# EAGLE schematic AutoPad-R3-RevA (EAGLE 9.5.2), part 2 of 3
## Sheet 6 of 12
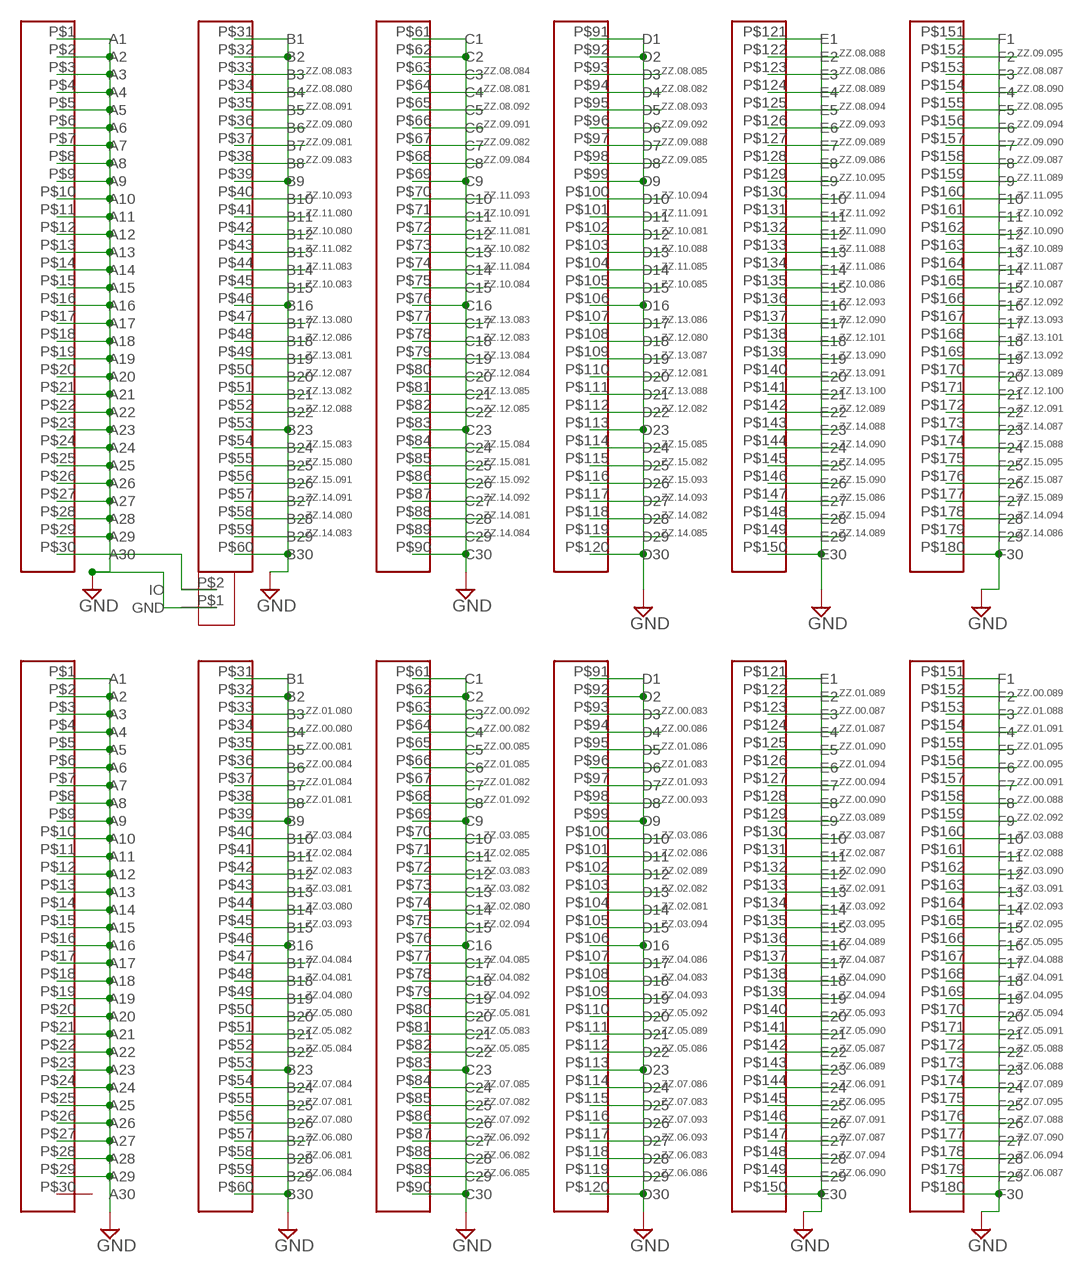
[diagram p5: schematic, sheet 6]

### Parts
U$11  SEAM-30-02.0-L-06-1-A-K-TR  [SEAM-30-02.0-L-06-1-A-K-TR]
U$12  SEAM-30-02.0-L-06-1-A-K-TR  [SEAM-30-02.0-L-06-1-A-K-TR]
U$30  DS2431  [SD2431]

### Nets
GND: U$11.P$1(A1) U$11.P$2(A2) U$11.P$3(A3) U$11.P$4(A4) U$11.P$5(A5) U$11.P$6(A6) U$11.P$7(A7) U$11.P$8(A8) U$11.P$9(A9) U$11.P$10(A10) U$11.P$11(A11) U$11.P$12(A12) U$11.P$13(A13) U$11.P$14(A14) U$11.P$15(A15) U$11.P$16(A16) U$11.P$17(A17) U$11.P$18(A18) U$11.P$19(A19) U$11.P$20(A20) U$11.P$21(A21) U$11.P$22(A22) U$11.P$23(A23) U$11.P$24(A24) U$11.P$25(A25) U$11.P$26(A26) U$11.P$27(A27) U$11.P$28(A28) U$11.P$29(A29) U$11.P$31(B1) U$11.P$32(B2) U$11.P$39(B9) U$11.P$46(B16) U$11.P$53(B23) U$11.P$60(B30) U$11.P$61(C1) U$11.P$62(C2) U$11.P$69(C9) U$11.P$76(C16) U$11.P$83(C23) U$11.P$90(C30) U$11.P$91(D1) U$11.P$92(D2) U$11.P$99(D9) U$11.P$106(D16) U$11.P$113(D23) U$11.P$120(D30) U$11.P$121(E1) U$11.P$150(E30) U$11.P$151(F1) U$11.P$180(F30) U$12.P$1(A1) U$12.P$2(A2) U$12.P$3(A3) U$12.P$4(A4) U$12.P$5(A5) U$12.P$6(A6) U$12.P$7(A7) U$12.P$8(A8) U$12.P$9(A9) U$12.P$10(A10) U$12.P$11(A11) U$12.P$12(A12) U$12.P$13(A13) U$12.P$14(A14) U$12.P$15(A15) U$12.P$16(A16) U$12.P$17(A17) U$12.P$18(A18) U$12.P$19(A19) U$12.P$20(A20) U$12.P$21(A21) U$12.P$22(A22) U$12.P$23(A23) U$12.P$24(A24) U$12.P$25(A25) U$12.P$26(A26) U$12.P$27(A27) U$12.P$28(A28) U$12.P$29(A29) U$12.P$31(B1) U$12.P$32(B2) U$12.P$39(B9) U$12.P$46(B16) U$12.P$53(B23) U$12.P$60(B30) U$12.P$61(C1) U$12.P$62(C2) U$12.P$69(C9) U$12.P$76(C16) U$12.P$83(C23) U$12.P$90(C30) U$12.P$91(D1) U$12.P$92(D2) U$12.P$99(D9) U$12.P$106(D16) U$12.P$113(D23) U$12.P$120(D30) U$12.P$121(E1) U$12.P$150(E30) U$12.P$151(F1) U$12.P$180(F30) U$30.P$1(GND) ; also sheet 1,2,3,4,5,7,8,9,10,11,12
N$6: U$11.P$30(A30) U$30.P$2(IO)
ZZ.00.080: U$12.P$34(B4)
ZZ.00.081: U$12.P$35(B5)
ZZ.00.082: U$12.P$64(C4)
ZZ.00.083: U$12.P$93(D3)
ZZ.00.084: U$12.P$36(B6)
ZZ.00.085: U$12.P$65(C5)
ZZ.00.086: U$12.P$94(D4)
ZZ.00.087: U$12.P$123(E3)
ZZ.00.088: U$12.P$158(F8)
ZZ.00.089: U$12.P$152(F2)
ZZ.00.090: U$12.P$128(E8)
ZZ.00.091: U$12.P$157(F7)
ZZ.00.092: U$12.P$63(C3)
ZZ.00.093: U$12.P$98(D8)
ZZ.00.094: U$12.P$127(E7)
ZZ.00.095: U$12.P$156(F6)
ZZ.01.080: U$12.P$33(B3)
ZZ.01.081: U$12.P$38(B8)
ZZ.01.082: U$12.P$67(C7)
ZZ.01.083: U$12.P$96(D6)
ZZ.01.084: U$12.P$37(B7)
ZZ.01.085: U$12.P$66(C6)
ZZ.01.086: U$12.P$95(D5)
ZZ.01.087: U$12.P$124(E4)
ZZ.01.088: U$12.P$153(F3)
ZZ.01.089: U$12.P$122(E2)
ZZ.01.090: U$12.P$125(E5)
ZZ.01.091: U$12.P$154(F4)
ZZ.01.092: U$12.P$68(C8)
ZZ.01.093: U$12.P$97(D7)
ZZ.01.094: U$12.P$126(E6)
ZZ.01.095: U$12.P$155(F5)
ZZ.02.080: U$12.P$74(C14)
ZZ.02.081: U$12.P$104(D14)
ZZ.02.082: U$12.P$103(D13)
ZZ.02.083: U$12.P$42(B12)
ZZ.02.084: U$12.P$41(B11)
ZZ.02.085: U$12.P$71(C11)
ZZ.02.086: U$12.P$101(D11)
ZZ.02.087: U$12.P$131(E11)
ZZ.02.088: U$12.P$161(F11)
ZZ.02.089: U$12.P$102(D12)
ZZ.02.090: U$12.P$132(E12)
ZZ.02.091: U$12.P$133(E13)
ZZ.02.092: U$12.P$159(F9)
ZZ.02.093: U$12.P$164(F14)
ZZ.02.094: U$12.P$75(C15)
ZZ.02.095: U$12.P$165(F15)
ZZ.03.080: U$12.P$44(B14)
ZZ.03.081: U$12.P$43(B13)
ZZ.03.082: U$12.P$73(C13)
ZZ.03.083: U$12.P$72(C12)
ZZ.03.084: U$12.P$40(B10)
ZZ.03.085: U$12.P$70(C10)
ZZ.03.086: U$12.P$100(D10)
ZZ.03.087: U$12.P$130(E10)
ZZ.03.088: U$12.P$160(F10)
ZZ.03.089: U$12.P$129(E9)
ZZ.03.090: U$12.P$162(F12)
ZZ.03.091: U$12.P$163(F13)
ZZ.03.092: U$12.P$134(E14)
ZZ.03.093: U$12.P$45(B15)
ZZ.03.094: U$12.P$105(D15)
ZZ.03.095: U$12.P$135(E15)
ZZ.04.080: U$12.P$49(B19)
ZZ.04.081: U$12.P$48(B18)
ZZ.04.082: U$12.P$78(C18)
ZZ.04.083: U$12.P$108(D18)
ZZ.04.084: U$12.P$47(B17)
ZZ.04.085: U$12.P$77(C17)
ZZ.04.086: U$12.P$107(D17)
ZZ.04.087: U$12.P$137(E17)
ZZ.04.088: U$12.P$167(F17)
ZZ.04.089: U$12.P$136(E16)
ZZ.04.090: U$12.P$138(E18)
ZZ.04.091: U$12.P$168(F18)
ZZ.04.092: U$12.P$79(C19)
ZZ.04.093: U$12.P$109(D19)
ZZ.04.094: U$12.P$139(E19)
ZZ.04.095: U$12.P$169(F19)
ZZ.05.080: U$12.P$50(B20)
ZZ.05.081: U$12.P$80(C20)
ZZ.05.082: U$12.P$51(B21)
ZZ.05.083: U$12.P$81(C21)
ZZ.05.084: U$12.P$52(B22)
ZZ.05.085: U$12.P$82(C22)
ZZ.05.086: U$12.P$112(D22)
ZZ.05.087: U$12.P$142(E22)
ZZ.05.088: U$12.P$172(F22)
ZZ.05.089: U$12.P$111(D21)
ZZ.05.090: U$12.P$141(E21)
ZZ.05.091: U$12.P$171(F21)
ZZ.05.092: U$12.P$110(D20)
ZZ.05.093: U$12.P$140(E20)
ZZ.05.094: U$12.P$170(F20)
ZZ.05.095: U$12.P$166(F16)
ZZ.06.080: U$12.P$57(B27)
ZZ.06.081: U$12.P$58(B28)
ZZ.06.082: U$12.P$88(C28)
ZZ.06.083: U$12.P$118(D28)
ZZ.06.084: U$12.P$59(B29)
ZZ.06.085: U$12.P$89(C29)
ZZ.06.086: U$12.P$119(D29)
ZZ.06.087: U$12.P$179(F29)
ZZ.06.088: U$12.P$173(F23)
ZZ.06.089: U$12.P$143(E23)
ZZ.06.090: U$12.P$149(E29)
ZZ.06.091: U$12.P$144(E24)
ZZ.06.092: U$12.P$87(C27)
ZZ.06.093: U$12.P$117(D27)
ZZ.06.094: U$12.P$178(F28)
ZZ.06.095: U$12.P$145(E25)
ZZ.07.080: U$12.P$56(B26)
ZZ.07.081: U$12.P$55(B25)
ZZ.07.082: U$12.P$85(C25)
ZZ.07.083: U$12.P$115(D25)
ZZ.07.084: U$12.P$54(B24)
ZZ.07.085: U$12.P$84(C24)
ZZ.07.086: U$12.P$114(D24)
ZZ.07.087: U$12.P$147(E27)
ZZ.07.088: U$12.P$176(F26)
ZZ.07.089: U$12.P$174(F24)
ZZ.07.090: U$12.P$177(F27)
ZZ.07.091: U$12.P$146(E26)
ZZ.07.092: U$12.P$86(C26)
ZZ.07.093: U$12.P$116(D26)
ZZ.07.094: U$12.P$148(E28)
ZZ.07.095: U$12.P$175(F25)
ZZ.08.080: U$11.P$34(B4)
ZZ.08.081: U$11.P$64(C4)
ZZ.08.082: U$11.P$94(D4)
ZZ.08.083: U$11.P$33(B3)
ZZ.08.084: U$11.P$63(C3)
ZZ.08.085: U$11.P$93(D3)
ZZ.08.086: U$11.P$123(E3)
ZZ.08.087: U$11.P$153(F3)
ZZ.08.088: U$11.P$122(E2)
ZZ.08.089: U$11.P$124(E4)
ZZ.08.090: U$11.P$154(F4)
ZZ.08.091: U$11.P$35(B5)
ZZ.08.092: U$11.P$65(C5)
ZZ.08.093: U$11.P$95(D5)
ZZ.08.094: U$11.P$125(E5)
ZZ.08.095: U$11.P$155(F5)
ZZ.09.080: U$11.P$36(B6)
ZZ.09.081: U$11.P$37(B7)
ZZ.09.082: U$11.P$67(C7)
ZZ.09.083: U$11.P$38(B8)
ZZ.09.084: U$11.P$68(C8)
ZZ.09.085: U$11.P$98(D8)
ZZ.09.086: U$11.P$128(E8)
ZZ.09.087: U$11.P$158(F8)
ZZ.09.088: U$11.P$97(D7)
ZZ.09.089: U$11.P$127(E7)
ZZ.09.090: U$11.P$157(F7)
ZZ.09.091: U$11.P$66(C6)
ZZ.09.092: U$11.P$96(D6)
ZZ.09.093: U$11.P$126(E6)
ZZ.09.094: U$11.P$156(F6)
ZZ.09.095: U$11.P$152(F2)
ZZ.10.080: U$11.P$42(B12)
ZZ.10.081: U$11.P$102(D12)
ZZ.10.082: U$11.P$73(C13)
ZZ.10.083: U$11.P$45(B15)
ZZ.10.084: U$11.P$75(C15)
ZZ.10.085: U$11.P$105(D15)
ZZ.10.086: U$11.P$135(E15)
ZZ.10.087: U$11.P$165(F15)
ZZ.10.088: U$11.P$103(D13)
ZZ.10.089: U$11.P$163(F13)
ZZ.10.090: U$11.P$162(F12)
ZZ.10.091: U$11.P$71(C11)
ZZ.10.092: U$11.P$161(F11)
ZZ.10.093: U$11.P$40(B10)
ZZ.10.094: U$11.P$100(D10)
ZZ.10.095: U$11.P$129(E9)
ZZ.11.080: U$11.P$41(B11)
ZZ.11.081: U$11.P$72(C12)
ZZ.11.082: U$11.P$43(B13)
ZZ.11.083: U$11.P$44(B14)
ZZ.11.084: U$11.P$74(C14)
ZZ.11.085: U$11.P$104(D14)
ZZ.11.086: U$11.P$134(E14)
ZZ.11.087: U$11.P$164(F14)
ZZ.11.088: U$11.P$133(E13)
ZZ.11.089: U$11.P$159(F9)
ZZ.11.090: U$11.P$132(E12)
ZZ.11.091: U$11.P$101(D11)
ZZ.11.092: U$11.P$131(E11)
ZZ.11.093: U$11.P$70(C10)
ZZ.11.094: U$11.P$130(E10)
ZZ.11.095: U$11.P$160(F10)
ZZ.12.080: U$11.P$108(D18)
ZZ.12.081: U$11.P$110(D20)
ZZ.12.082: U$11.P$112(D22)
ZZ.12.083: U$11.P$78(C18)
ZZ.12.084: U$11.P$80(C20)
ZZ.12.085: U$11.P$82(C22)
ZZ.12.086: U$11.P$48(B18)
ZZ.12.087: U$11.P$50(B20)
ZZ.12.088: U$11.P$52(B22)
ZZ.12.089: U$11.P$142(E22)
ZZ.12.090: U$11.P$137(E17)
ZZ.12.091: U$11.P$172(F22)
ZZ.12.092: U$11.P$166(F16)
ZZ.12.093: U$11.P$136(E16)
ZZ.12.100: U$11.P$171(F21)
ZZ.12.101: U$11.P$138(E18)
ZZ.13.080: U$11.P$47(B17)
ZZ.13.081: U$11.P$49(B19)
ZZ.13.082: U$11.P$51(B21)
ZZ.13.083: U$11.P$77(C17)
ZZ.13.084: U$11.P$79(C19)
ZZ.13.085: U$11.P$81(C21)
ZZ.13.086: U$11.P$107(D17)
ZZ.13.087: U$11.P$109(D19)
ZZ.13.088: U$11.P$111(D21)
ZZ.13.089: U$11.P$170(F20)
ZZ.13.090: U$11.P$139(E19)
ZZ.13.091: U$11.P$140(E20)
ZZ.13.092: U$11.P$169(F19)
ZZ.13.093: U$11.P$167(F17)
ZZ.13.100: U$11.P$141(E21)
ZZ.13.101: U$11.P$168(F18)
ZZ.14.080: U$11.P$58(B28)
ZZ.14.081: U$11.P$88(C28)
ZZ.14.082: U$11.P$118(D28)
ZZ.14.083: U$11.P$59(B29)
ZZ.14.084: U$11.P$89(C29)
ZZ.14.085: U$11.P$119(D29)
ZZ.14.086: U$11.P$179(F29)
ZZ.14.087: U$11.P$173(F23)
ZZ.14.088: U$11.P$143(E23)
ZZ.14.089: U$11.P$149(E29)
ZZ.14.090: U$11.P$144(E24)
ZZ.14.091: U$11.P$57(B27)
ZZ.14.092: U$11.P$87(C27)
ZZ.14.093: U$11.P$117(D27)
ZZ.14.094: U$11.P$178(F28)
ZZ.14.095: U$11.P$145(E25)
ZZ.15.080: U$11.P$55(B25)
ZZ.15.081: U$11.P$85(C25)
ZZ.15.082: U$11.P$115(D25)
ZZ.15.083: U$11.P$54(B24)
ZZ.15.084: U$11.P$84(C24)
ZZ.15.085: U$11.P$114(D24)
ZZ.15.086: U$11.P$147(E27)
ZZ.15.087: U$11.P$176(F26)
ZZ.15.088: U$11.P$174(F24)
ZZ.15.089: U$11.P$177(F27)
ZZ.15.090: U$11.P$146(E26)
ZZ.15.091: U$11.P$56(B26)
ZZ.15.092: U$11.P$86(C26)
ZZ.15.093: U$11.P$116(D26)
ZZ.15.094: U$11.P$148(E28)
ZZ.15.095: U$11.P$175(F25)
Unconnected: U$12.P$30(A30)

## Sheet 7 of 12
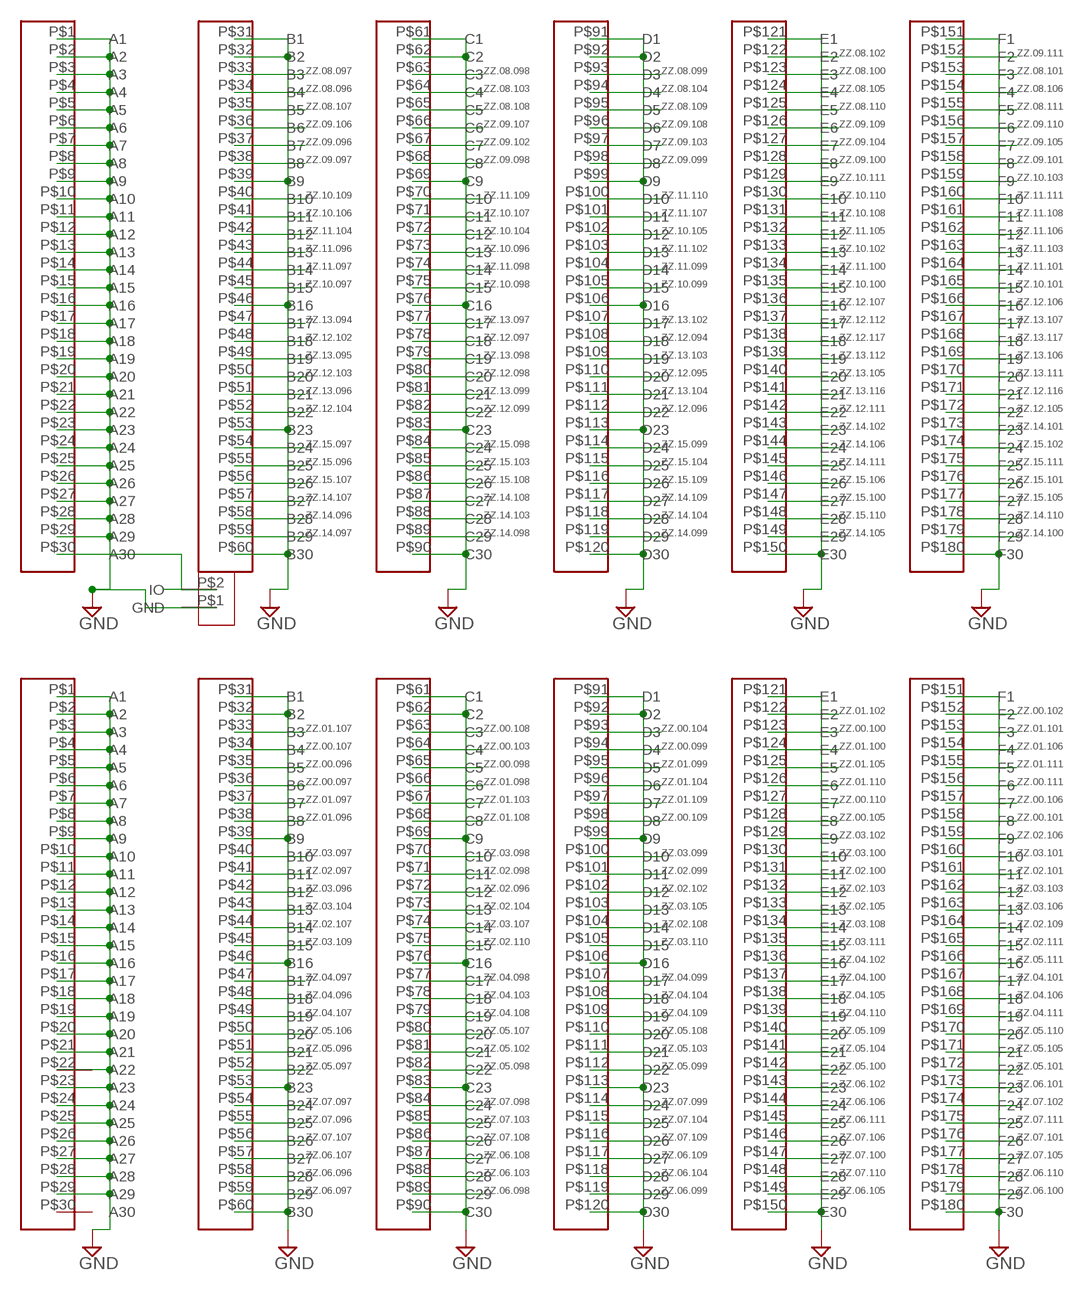
[diagram p6: schematic, sheet 7]

### Parts
U$13  SEAM-30-02.0-L-06-1-A-K-TR  [SEAM-30-02.0-L-06-1-A-K-TR]
U$14  SEAM-30-02.0-L-06-1-A-K-TR  [SEAM-30-02.0-L-06-1-A-K-TR]
U$31  DS2431  [SD2431]

### Nets
GND: U$13.P$1(A1) U$13.P$2(A2) U$13.P$3(A3) U$13.P$4(A4) U$13.P$5(A5) U$13.P$6(A6) U$13.P$7(A7) U$13.P$8(A8) U$13.P$9(A9) U$13.P$10(A10) U$13.P$11(A11) U$13.P$12(A12) U$13.P$13(A13) U$13.P$14(A14) U$13.P$15(A15) U$13.P$16(A16) U$13.P$17(A17) U$13.P$18(A18) U$13.P$19(A19) U$13.P$20(A20) U$13.P$21(A21) U$13.P$22(A22) U$13.P$23(A23) U$13.P$24(A24) U$13.P$25(A25) U$13.P$26(A26) U$13.P$27(A27) U$13.P$28(A28) U$13.P$29(A29) U$13.P$31(B1) U$13.P$32(B2) U$13.P$39(B9) U$13.P$46(B16) U$13.P$53(B23) U$13.P$60(B30) U$13.P$61(C1) U$13.P$62(C2) U$13.P$69(C9) U$13.P$76(C16) U$13.P$83(C23) U$13.P$90(C30) U$13.P$91(D1) U$13.P$92(D2) U$13.P$99(D9) U$13.P$106(D16) U$13.P$113(D23) U$13.P$120(D30) U$13.P$121(E1) U$13.P$150(E30) U$13.P$151(F1) U$13.P$180(F30) U$14.P$1(A1) U$14.P$2(A2) U$14.P$3(A3) U$14.P$4(A4) U$14.P$5(A5) U$14.P$6(A6) U$14.P$7(A7) U$14.P$8(A8) U$14.P$9(A9) U$14.P$10(A10) U$14.P$11(A11) U$14.P$12(A12) U$14.P$13(A13) U$14.P$14(A14) U$14.P$15(A15) U$14.P$16(A16) U$14.P$17(A17) U$14.P$18(A18) U$14.P$19(A19) U$14.P$20(A20) U$14.P$21(A21) U$14.P$22(A22) U$14.P$23(A23) U$14.P$24(A24) U$14.P$25(A25) U$14.P$26(A26) U$14.P$27(A27) U$14.P$28(A28) U$14.P$29(A29) U$14.P$31(B1) U$14.P$32(B2) U$14.P$39(B9) U$14.P$46(B16) U$14.P$53(B23) U$14.P$60(B30) U$14.P$61(C1) U$14.P$62(C2) U$14.P$69(C9) U$14.P$76(C16) U$14.P$83(C23) U$14.P$90(C30) U$14.P$91(D1) U$14.P$92(D2) U$14.P$99(D9) U$14.P$106(D16) U$14.P$113(D23) U$14.P$120(D30) U$14.P$121(E1) U$14.P$150(E30) U$14.P$151(F1) U$14.P$180(F30) U$31.P$1(GND) ; also sheet 1,2,3,4,5,6,8,9,10,11,12
N$7: U$13.P$30(A30) U$31.P$2(IO)
ZZ.00.096: U$14.P$35(B5)
ZZ.00.097: U$14.P$36(B6)
ZZ.00.098: U$14.P$65(C5)
ZZ.00.099: U$14.P$94(D4)
ZZ.00.100: U$14.P$123(E3)
ZZ.00.101: U$14.P$158(F8)
ZZ.00.102: U$14.P$152(F2)
ZZ.00.103: U$14.P$64(C4)
ZZ.00.104: U$14.P$93(D3)
ZZ.00.105: U$14.P$128(E8)
ZZ.00.106: U$14.P$157(F7)
ZZ.00.107: U$14.P$34(B4)
ZZ.00.108: U$14.P$63(C3)
ZZ.00.109: U$14.P$98(D8)
ZZ.00.110: U$14.P$127(E7)
ZZ.00.111: U$14.P$156(F6)
ZZ.01.096: U$14.P$38(B8)
ZZ.01.097: U$14.P$37(B7)
ZZ.01.098: U$14.P$66(C6)
ZZ.01.099: U$14.P$95(D5)
ZZ.01.100: U$14.P$124(E4)
ZZ.01.101: U$14.P$153(F3)
ZZ.01.102: U$14.P$122(E2)
ZZ.01.103: U$14.P$67(C7)
ZZ.01.104: U$14.P$96(D6)
ZZ.01.105: U$14.P$125(E5)
ZZ.01.106: U$14.P$154(F4)
ZZ.01.107: U$14.P$33(B3)
ZZ.01.108: U$14.P$68(C8)
ZZ.01.109: U$14.P$97(D7)
ZZ.01.110: U$14.P$126(E6)
ZZ.01.111: U$14.P$155(F5)
ZZ.02.096: U$14.P$72(C12)
ZZ.02.097: U$14.P$41(B11)
ZZ.02.098: U$14.P$71(C11)
ZZ.02.099: U$14.P$101(D11)
ZZ.02.100: U$14.P$131(E11)
ZZ.02.101: U$14.P$161(F11)
ZZ.02.102: U$14.P$102(D12)
ZZ.02.103: U$14.P$132(E12)
ZZ.02.104: U$14.P$73(C13)
ZZ.02.105: U$14.P$133(E13)
ZZ.02.106: U$14.P$159(F9)
ZZ.02.107: U$14.P$44(B14)
ZZ.02.108: U$14.P$104(D14)
ZZ.02.109: U$14.P$164(F14)
ZZ.02.110: U$14.P$75(C15)
ZZ.02.111: U$14.P$165(F15)
ZZ.03.096: U$14.P$42(B12)
ZZ.03.097: U$14.P$40(B10)
ZZ.03.098: U$14.P$70(C10)
ZZ.03.099: U$14.P$100(D10)
ZZ.03.100: U$14.P$130(E10)
ZZ.03.101: U$14.P$160(F10)
ZZ.03.102: U$14.P$129(E9)
ZZ.03.103: U$14.P$162(F12)
ZZ.03.104: U$14.P$43(B13)
ZZ.03.105: U$14.P$103(D13)
ZZ.03.106: U$14.P$163(F13)
ZZ.03.107: U$14.P$74(C14)
ZZ.03.108: U$14.P$134(E14)
ZZ.03.109: U$14.P$45(B15)
ZZ.03.110: U$14.P$105(D15)
ZZ.03.111: U$14.P$135(E15)
ZZ.04.096: U$14.P$48(B18)
ZZ.04.097: U$14.P$47(B17)
ZZ.04.098: U$14.P$77(C17)
ZZ.04.099: U$14.P$107(D17)
ZZ.04.100: U$14.P$137(E17)
ZZ.04.101: U$14.P$167(F17)
ZZ.04.102: U$14.P$136(E16)
ZZ.04.103: U$14.P$78(C18)
ZZ.04.104: U$14.P$108(D18)
ZZ.04.105: U$14.P$138(E18)
ZZ.04.106: U$14.P$168(F18)
ZZ.04.107: U$14.P$49(B19)
ZZ.04.108: U$14.P$79(C19)
ZZ.04.109: U$14.P$109(D19)
ZZ.04.110: U$14.P$139(E19)
ZZ.04.111: U$14.P$169(F19)
ZZ.05.096: U$14.P$51(B21)
ZZ.05.097: U$14.P$52(B22)
ZZ.05.098: U$14.P$82(C22)
ZZ.05.099: U$14.P$112(D22)
ZZ.05.100: U$14.P$142(E22)
ZZ.05.101: U$14.P$172(F22)
ZZ.05.102: U$14.P$81(C21)
ZZ.05.103: U$14.P$111(D21)
ZZ.05.104: U$14.P$141(E21)
ZZ.05.105: U$14.P$171(F21)
ZZ.05.106: U$14.P$50(B20)
ZZ.05.107: U$14.P$80(C20)
ZZ.05.108: U$14.P$110(D20)
ZZ.05.109: U$14.P$140(E20)
ZZ.05.110: U$14.P$170(F20)
ZZ.05.111: U$14.P$166(F16)
ZZ.06.096: U$14.P$58(B28)
ZZ.06.097: U$14.P$59(B29)
ZZ.06.098: U$14.P$89(C29)
ZZ.06.099: U$14.P$119(D29)
ZZ.06.100: U$14.P$179(F29)
ZZ.06.101: U$14.P$173(F23)
ZZ.06.102: U$14.P$143(E23)
ZZ.06.103: U$14.P$88(C28)
ZZ.06.104: U$14.P$118(D28)
ZZ.06.105: U$14.P$149(E29)
ZZ.06.106: U$14.P$144(E24)
ZZ.06.107: U$14.P$57(B27)
ZZ.06.108: U$14.P$87(C27)
ZZ.06.109: U$14.P$117(D27)
ZZ.06.110: U$14.P$178(F28)
ZZ.06.111: U$14.P$145(E25)
ZZ.07.096: U$14.P$55(B25)
ZZ.07.097: U$14.P$54(B24)
ZZ.07.098: U$14.P$84(C24)
ZZ.07.099: U$14.P$114(D24)
ZZ.07.100: U$14.P$147(E27)
ZZ.07.101: U$14.P$176(F26)
ZZ.07.102: U$14.P$174(F24)
ZZ.07.103: U$14.P$85(C25)
ZZ.07.104: U$14.P$115(D25)
ZZ.07.105: U$14.P$177(F27)
ZZ.07.106: U$14.P$146(E26)
ZZ.07.107: U$14.P$56(B26)
ZZ.07.108: U$14.P$86(C26)
ZZ.07.109: U$14.P$116(D26)
ZZ.07.110: U$14.P$148(E28)
ZZ.07.111: U$14.P$175(F25)
ZZ.08.096: U$13.P$34(B4)
ZZ.08.097: U$13.P$33(B3)
ZZ.08.098: U$13.P$63(C3)
ZZ.08.099: U$13.P$93(D3)
ZZ.08.100: U$13.P$123(E3)
ZZ.08.101: U$13.P$153(F3)
ZZ.08.102: U$13.P$122(E2)
ZZ.08.103: U$13.P$64(C4)
ZZ.08.104: U$13.P$94(D4)
ZZ.08.105: U$13.P$124(E4)
ZZ.08.106: U$13.P$154(F4)
ZZ.08.107: U$13.P$35(B5)
ZZ.08.108: U$13.P$65(C5)
ZZ.08.109: U$13.P$95(D5)
ZZ.08.110: U$13.P$125(E5)
ZZ.08.111: U$13.P$155(F5)
ZZ.09.096: U$13.P$37(B7)
ZZ.09.097: U$13.P$38(B8)
ZZ.09.098: U$13.P$68(C8)
ZZ.09.099: U$13.P$98(D8)
ZZ.09.100: U$13.P$128(E8)
ZZ.09.101: U$13.P$158(F8)
ZZ.09.102: U$13.P$67(C7)
ZZ.09.103: U$13.P$97(D7)
ZZ.09.104: U$13.P$127(E7)
ZZ.09.105: U$13.P$157(F7)
ZZ.09.106: U$13.P$36(B6)
ZZ.09.107: U$13.P$66(C6)
ZZ.09.108: U$13.P$96(D6)
ZZ.09.109: U$13.P$126(E6)
ZZ.09.110: U$13.P$156(F6)
ZZ.09.111: U$13.P$152(F2)
ZZ.10.096: U$13.P$73(C13)
ZZ.10.097: U$13.P$45(B15)
ZZ.10.098: U$13.P$75(C15)
ZZ.10.099: U$13.P$105(D15)
ZZ.10.100: U$13.P$135(E15)
ZZ.10.101: U$13.P$165(F15)
ZZ.10.102: U$13.P$133(E13)
ZZ.10.103: U$13.P$159(F9)
ZZ.10.104: U$13.P$72(C12)
ZZ.10.105: U$13.P$102(D12)
ZZ.10.106: U$13.P$41(B11)
ZZ.10.107: U$13.P$71(C11)
ZZ.10.108: U$13.P$131(E11)
ZZ.10.109: U$13.P$40(B10)
ZZ.10.110: U$13.P$130(E10)
ZZ.10.111: U$13.P$129(E9)
ZZ.11.096: U$13.P$43(B13)
ZZ.11.097: U$13.P$44(B14)
ZZ.11.098: U$13.P$74(C14)
ZZ.11.099: U$13.P$104(D14)
ZZ.11.100: U$13.P$134(E14)
ZZ.11.101: U$13.P$164(F14)
ZZ.11.102: U$13.P$103(D13)
ZZ.11.103: U$13.P$163(F13)
ZZ.11.104: U$13.P$42(B12)
ZZ.11.105: U$13.P$132(E12)
ZZ.11.106: U$13.P$162(F12)
ZZ.11.107: U$13.P$101(D11)
ZZ.11.108: U$13.P$161(F11)
ZZ.11.109: U$13.P$70(C10)
ZZ.11.110: U$13.P$100(D10)
ZZ.11.111: U$13.P$160(F10)
ZZ.12.094: U$13.P$108(D18)
ZZ.12.095: U$13.P$110(D20)
ZZ.12.096: U$13.P$112(D22)
ZZ.12.097: U$13.P$78(C18)
ZZ.12.098: U$13.P$80(C20)
ZZ.12.099: U$13.P$82(C22)
ZZ.12.102: U$13.P$48(B18)
ZZ.12.103: U$13.P$50(B20)
ZZ.12.104: U$13.P$52(B22)
ZZ.12.105: U$13.P$172(F22)
ZZ.12.106: U$13.P$166(F16)
ZZ.12.107: U$13.P$136(E16)
ZZ.12.111: U$13.P$142(E22)
ZZ.12.112: U$13.P$137(E17)
ZZ.12.116: U$13.P$171(F21)
ZZ.12.117: U$13.P$138(E18)
ZZ.13.094: U$13.P$47(B17)
ZZ.13.095: U$13.P$49(B19)
ZZ.13.096: U$13.P$51(B21)
ZZ.13.097: U$13.P$77(C17)
ZZ.13.098: U$13.P$79(C19)
ZZ.13.099: U$13.P$81(C21)
ZZ.13.102: U$13.P$107(D17)
ZZ.13.103: U$13.P$109(D19)
ZZ.13.104: U$13.P$111(D21)
ZZ.13.105: U$13.P$140(E20)
ZZ.13.106: U$13.P$169(F19)
ZZ.13.107: U$13.P$167(F17)
ZZ.13.111: U$13.P$170(F20)
ZZ.13.112: U$13.P$139(E19)
ZZ.13.116: U$13.P$141(E21)
ZZ.13.117: U$13.P$168(F18)
ZZ.14.096: U$13.P$58(B28)
ZZ.14.097: U$13.P$59(B29)
ZZ.14.098: U$13.P$89(C29)
ZZ.14.099: U$13.P$119(D29)
ZZ.14.100: U$13.P$179(F29)
ZZ.14.101: U$13.P$173(F23)
ZZ.14.102: U$13.P$143(E23)
ZZ.14.103: U$13.P$88(C28)
ZZ.14.104: U$13.P$118(D28)
ZZ.14.105: U$13.P$149(E29)
ZZ.14.106: U$13.P$144(E24)
ZZ.14.107: U$13.P$57(B27)
ZZ.14.108: U$13.P$87(C27)
ZZ.14.109: U$13.P$117(D27)
ZZ.14.110: U$13.P$178(F28)
ZZ.14.111: U$13.P$145(E25)
ZZ.15.096: U$13.P$55(B25)
ZZ.15.097: U$13.P$54(B24)
ZZ.15.098: U$13.P$84(C24)
ZZ.15.099: U$13.P$114(D24)
ZZ.15.100: U$13.P$147(E27)
ZZ.15.101: U$13.P$176(F26)
ZZ.15.102: U$13.P$174(F24)
ZZ.15.103: U$13.P$85(C25)
ZZ.15.104: U$13.P$115(D25)
ZZ.15.105: U$13.P$177(F27)
ZZ.15.106: U$13.P$146(E26)
ZZ.15.107: U$13.P$56(B26)
ZZ.15.108: U$13.P$86(C26)
ZZ.15.109: U$13.P$116(D26)
ZZ.15.110: U$13.P$148(E28)
ZZ.15.111: U$13.P$175(F25)
Unconnected: U$14.P$30(A30)

## Sheet 8 of 12
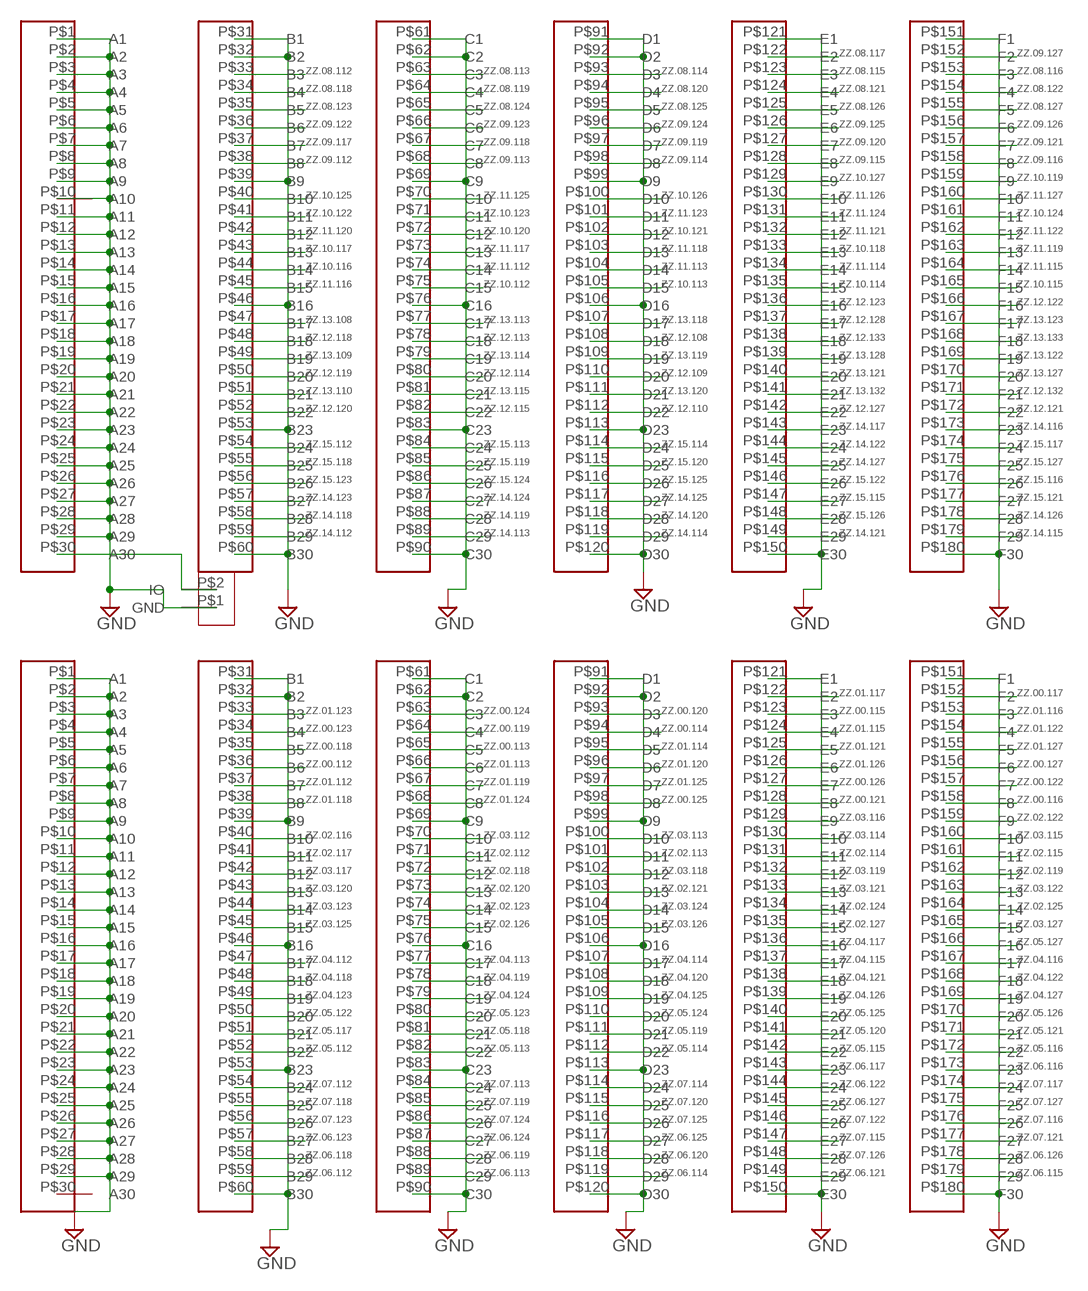
[diagram p7: schematic, sheet 8]

### Parts
U$15  SEAM-30-02.0-L-06-1-A-K-TR  [SEAM-30-02.0-L-06-1-A-K-TR]
U$16  SEAM-30-02.0-L-06-1-A-K-TR  [SEAM-30-02.0-L-06-1-A-K-TR]
U$32  DS2431  [SD2431]

### Nets
GND: U$15.P$1(A1) U$15.P$2(A2) U$15.P$3(A3) U$15.P$4(A4) U$15.P$5(A5) U$15.P$6(A6) U$15.P$7(A7) U$15.P$8(A8) U$15.P$9(A9) U$15.P$10(A10) U$15.P$11(A11) U$15.P$12(A12) U$15.P$13(A13) U$15.P$14(A14) U$15.P$15(A15) U$15.P$16(A16) U$15.P$17(A17) U$15.P$18(A18) U$15.P$19(A19) U$15.P$20(A20) U$15.P$21(A21) U$15.P$22(A22) U$15.P$23(A23) U$15.P$24(A24) U$15.P$25(A25) U$15.P$26(A26) U$15.P$27(A27) U$15.P$28(A28) U$15.P$29(A29) U$15.P$31(B1) U$15.P$32(B2) U$15.P$39(B9) U$15.P$46(B16) U$15.P$53(B23) U$15.P$60(B30) U$15.P$61(C1) U$15.P$62(C2) U$15.P$69(C9) U$15.P$76(C16) U$15.P$83(C23) U$15.P$90(C30) U$15.P$91(D1) U$15.P$92(D2) U$15.P$99(D9) U$15.P$106(D16) U$15.P$113(D23) U$15.P$120(D30) U$15.P$121(E1) U$15.P$150(E30) U$15.P$151(F1) U$15.P$180(F30) U$16.P$1(A1) U$16.P$2(A2) U$16.P$3(A3) U$16.P$4(A4) U$16.P$5(A5) U$16.P$6(A6) U$16.P$7(A7) U$16.P$8(A8) U$16.P$9(A9) U$16.P$10(A10) U$16.P$11(A11) U$16.P$12(A12) U$16.P$13(A13) U$16.P$14(A14) U$16.P$15(A15) U$16.P$16(A16) U$16.P$17(A17) U$16.P$18(A18) U$16.P$19(A19) U$16.P$20(A20) U$16.P$21(A21) U$16.P$22(A22) U$16.P$23(A23) U$16.P$24(A24) U$16.P$25(A25) U$16.P$26(A26) U$16.P$27(A27) U$16.P$28(A28) U$16.P$29(A29) U$16.P$31(B1) U$16.P$32(B2) U$16.P$39(B9) U$16.P$46(B16) U$16.P$53(B23) U$16.P$60(B30) U$16.P$61(C1) U$16.P$62(C2) U$16.P$69(C9) U$16.P$76(C16) U$16.P$83(C23) U$16.P$90(C30) U$16.P$91(D1) U$16.P$92(D2) U$16.P$99(D9) U$16.P$106(D16) U$16.P$113(D23) U$16.P$120(D30) U$16.P$121(E1) U$16.P$150(E30) U$16.P$151(F1) U$16.P$180(F30) U$32.P$1(GND) ; also sheet 1,2,3,4,5,6,7,9,10,11,12
N$8: U$15.P$30(A30) U$32.P$2(IO)
ZZ.00.112: U$16.P$36(B6)
ZZ.00.113: U$16.P$65(C5)
ZZ.00.114: U$16.P$94(D4)
ZZ.00.115: U$16.P$123(E3)
ZZ.00.116: U$16.P$158(F8)
ZZ.00.117: U$16.P$152(F2)
ZZ.00.118: U$16.P$35(B5)
ZZ.00.119: U$16.P$64(C4)
ZZ.00.120: U$16.P$93(D3)
ZZ.00.121: U$16.P$128(E8)
ZZ.00.122: U$16.P$157(F7)
ZZ.00.123: U$16.P$34(B4)
ZZ.00.124: U$16.P$63(C3)
ZZ.00.125: U$16.P$98(D8)
ZZ.00.126: U$16.P$127(E7)
ZZ.00.127: U$16.P$156(F6)
ZZ.01.112: U$16.P$37(B7)
ZZ.01.113: U$16.P$66(C6)
ZZ.01.114: U$16.P$95(D5)
ZZ.01.115: U$16.P$124(E4)
ZZ.01.116: U$16.P$153(F3)
ZZ.01.117: U$16.P$122(E2)
ZZ.01.118: U$16.P$38(B8)
ZZ.01.119: U$16.P$67(C7)
ZZ.01.120: U$16.P$96(D6)
ZZ.01.121: U$16.P$125(E5)
ZZ.01.122: U$16.P$154(F4)
ZZ.01.123: U$16.P$33(B3)
ZZ.01.124: U$16.P$68(C8)
ZZ.01.125: U$16.P$97(D7)
ZZ.01.126: U$16.P$126(E6)
ZZ.01.127: U$16.P$155(F5)
ZZ.02.112: U$16.P$71(C11)
ZZ.02.113: U$16.P$101(D11)
ZZ.02.114: U$16.P$131(E11)
ZZ.02.115: U$16.P$161(F11)
ZZ.02.116: U$16.P$40(B10)
ZZ.02.117: U$16.P$41(B11)
ZZ.02.118: U$16.P$72(C12)
ZZ.02.119: U$16.P$162(F12)
ZZ.02.120: U$16.P$73(C13)
ZZ.02.121: U$16.P$103(D13)
ZZ.02.122: U$16.P$159(F9)
ZZ.02.123: U$16.P$74(C14)
ZZ.02.124: U$16.P$134(E14)
ZZ.02.125: U$16.P$164(F14)
ZZ.02.126: U$16.P$75(C15)
ZZ.02.127: U$16.P$135(E15)
ZZ.03.112: U$16.P$70(C10)
ZZ.03.113: U$16.P$100(D10)
ZZ.03.114: U$16.P$130(E10)
ZZ.03.115: U$16.P$160(F10)
ZZ.03.116: U$16.P$129(E9)
ZZ.03.117: U$16.P$42(B12)
ZZ.03.118: U$16.P$102(D12)
ZZ.03.119: U$16.P$132(E12)
ZZ.03.120: U$16.P$43(B13)
ZZ.03.121: U$16.P$133(E13)
ZZ.03.122: U$16.P$163(F13)
ZZ.03.123: U$16.P$44(B14)
ZZ.03.124: U$16.P$104(D14)
ZZ.03.125: U$16.P$45(B15)
ZZ.03.126: U$16.P$105(D15)
ZZ.03.127: U$16.P$165(F15)
ZZ.04.112: U$16.P$47(B17)
ZZ.04.113: U$16.P$77(C17)
ZZ.04.114: U$16.P$107(D17)
ZZ.04.115: U$16.P$137(E17)
ZZ.04.116: U$16.P$167(F17)
ZZ.04.117: U$16.P$136(E16)
ZZ.04.118: U$16.P$48(B18)
ZZ.04.119: U$16.P$78(C18)
ZZ.04.120: U$16.P$108(D18)
ZZ.04.121: U$16.P$138(E18)
ZZ.04.122: U$16.P$168(F18)
ZZ.04.123: U$16.P$49(B19)
ZZ.04.124: U$16.P$79(C19)
ZZ.04.125: U$16.P$109(D19)
ZZ.04.126: U$16.P$139(E19)
ZZ.04.127: U$16.P$169(F19)
ZZ.05.112: U$16.P$52(B22)
ZZ.05.113: U$16.P$82(C22)
ZZ.05.114: U$16.P$112(D22)
ZZ.05.115: U$16.P$142(E22)
ZZ.05.116: U$16.P$172(F22)
ZZ.05.117: U$16.P$51(B21)
ZZ.05.118: U$16.P$81(C21)
ZZ.05.119: U$16.P$111(D21)
ZZ.05.120: U$16.P$141(E21)
ZZ.05.121: U$16.P$171(F21)
ZZ.05.122: U$16.P$50(B20)
ZZ.05.123: U$16.P$80(C20)
ZZ.05.124: U$16.P$110(D20)
ZZ.05.125: U$16.P$140(E20)
ZZ.05.126: U$16.P$170(F20)
ZZ.05.127: U$16.P$166(F16)
ZZ.06.112: U$16.P$59(B29)
ZZ.06.113: U$16.P$89(C29)
ZZ.06.114: U$16.P$119(D29)
ZZ.06.115: U$16.P$179(F29)
ZZ.06.116: U$16.P$173(F23)
ZZ.06.117: U$16.P$143(E23)
ZZ.06.118: U$16.P$58(B28)
ZZ.06.119: U$16.P$88(C28)
ZZ.06.120: U$16.P$118(D28)
ZZ.06.121: U$16.P$149(E29)
ZZ.06.122: U$16.P$144(E24)
ZZ.06.123: U$16.P$57(B27)
ZZ.06.124: U$16.P$87(C27)
ZZ.06.125: U$16.P$117(D27)
ZZ.06.126: U$16.P$178(F28)
ZZ.06.127: U$16.P$145(E25)
ZZ.07.112: U$16.P$54(B24)
ZZ.07.113: U$16.P$84(C24)
ZZ.07.114: U$16.P$114(D24)
ZZ.07.115: U$16.P$147(E27)
ZZ.07.116: U$16.P$176(F26)
ZZ.07.117: U$16.P$174(F24)
ZZ.07.118: U$16.P$55(B25)
ZZ.07.119: U$16.P$85(C25)
ZZ.07.120: U$16.P$115(D25)
ZZ.07.121: U$16.P$177(F27)
ZZ.07.122: U$16.P$146(E26)
ZZ.07.123: U$16.P$56(B26)
ZZ.07.124: U$16.P$86(C26)
ZZ.07.125: U$16.P$116(D26)
ZZ.07.126: U$16.P$148(E28)
ZZ.07.127: U$16.P$175(F25)
ZZ.08.112: U$15.P$33(B3)
ZZ.08.113: U$15.P$63(C3)
ZZ.08.114: U$15.P$93(D3)
ZZ.08.115: U$15.P$123(E3)
ZZ.08.116: U$15.P$153(F3)
ZZ.08.117: U$15.P$122(E2)
ZZ.08.118: U$15.P$34(B4)
ZZ.08.119: U$15.P$64(C4)
ZZ.08.120: U$15.P$94(D4)
ZZ.08.121: U$15.P$124(E4)
ZZ.08.122: U$15.P$154(F4)
ZZ.08.123: U$15.P$35(B5)
ZZ.08.124: U$15.P$65(C5)
ZZ.08.125: U$15.P$95(D5)
ZZ.08.126: U$15.P$125(E5)
ZZ.08.127: U$15.P$155(F5)
ZZ.09.112: U$15.P$38(B8)
ZZ.09.113: U$15.P$68(C8)
ZZ.09.114: U$15.P$98(D8)
ZZ.09.115: U$15.P$128(E8)
ZZ.09.116: U$15.P$158(F8)
ZZ.09.117: U$15.P$37(B7)
ZZ.09.118: U$15.P$67(C7)
ZZ.09.119: U$15.P$97(D7)
ZZ.09.120: U$15.P$127(E7)
ZZ.09.121: U$15.P$157(F7)
ZZ.09.122: U$15.P$36(B6)
ZZ.09.123: U$15.P$66(C6)
ZZ.09.124: U$15.P$96(D6)
ZZ.09.125: U$15.P$126(E6)
ZZ.09.126: U$15.P$156(F6)
ZZ.09.127: U$15.P$152(F2)
ZZ.10.112: U$15.P$75(C15)
ZZ.10.113: U$15.P$105(D15)
ZZ.10.114: U$15.P$135(E15)
ZZ.10.115: U$15.P$165(F15)
ZZ.10.116: U$15.P$44(B14)
ZZ.10.117: U$15.P$43(B13)
ZZ.10.118: U$15.P$133(E13)
ZZ.10.119: U$15.P$159(F9)
ZZ.10.120: U$15.P$72(C12)
ZZ.10.121: U$15.P$102(D12)
ZZ.10.122: U$15.P$41(B11)
ZZ.10.123: U$15.P$71(C11)
ZZ.10.124: U$15.P$161(F11)
ZZ.10.125: U$15.P$40(B10)
ZZ.10.126: U$15.P$100(D10)
ZZ.10.127: U$15.P$129(E9)
ZZ.11.112: U$15.P$74(C14)
ZZ.11.113: U$15.P$104(D14)
ZZ.11.114: U$15.P$134(E14)
ZZ.11.115: U$15.P$164(F14)
ZZ.11.116: U$15.P$45(B15)
ZZ.11.117: U$15.P$73(C13)
ZZ.11.118: U$15.P$103(D13)
ZZ.11.119: U$15.P$163(F13)
ZZ.11.120: U$15.P$42(B12)
ZZ.11.121: U$15.P$132(E12)
ZZ.11.122: U$15.P$162(F12)
ZZ.11.123: U$15.P$101(D11)
ZZ.11.124: U$15.P$131(E11)
ZZ.11.125: U$15.P$70(C10)
ZZ.11.126: U$15.P$130(E10)
ZZ.11.127: U$15.P$160(F10)
ZZ.12.108: U$15.P$108(D18)
ZZ.12.109: U$15.P$110(D20)
ZZ.12.110: U$15.P$112(D22)
ZZ.12.113: U$15.P$78(C18)
ZZ.12.114: U$15.P$80(C20)
ZZ.12.115: U$15.P$82(C22)
ZZ.12.118: U$15.P$48(B18)
ZZ.12.119: U$15.P$50(B20)
ZZ.12.120: U$15.P$52(B22)
ZZ.12.121: U$15.P$172(F22)
ZZ.12.122: U$15.P$166(F16)
ZZ.12.123: U$15.P$136(E16)
ZZ.12.127: U$15.P$142(E22)
ZZ.12.128: U$15.P$137(E17)
ZZ.12.132: U$15.P$171(F21)
ZZ.12.133: U$15.P$138(E18)
ZZ.13.108: U$15.P$47(B17)
ZZ.13.109: U$15.P$49(B19)
ZZ.13.110: U$15.P$51(B21)
ZZ.13.113: U$15.P$77(C17)
ZZ.13.114: U$15.P$79(C19)
ZZ.13.115: U$15.P$81(C21)
ZZ.13.118: U$15.P$107(D17)
ZZ.13.119: U$15.P$109(D19)
ZZ.13.120: U$15.P$111(D21)
ZZ.13.121: U$15.P$140(E20)
ZZ.13.122: U$15.P$169(F19)
ZZ.13.123: U$15.P$167(F17)
ZZ.13.127: U$15.P$170(F20)
ZZ.13.128: U$15.P$139(E19)
ZZ.13.132: U$15.P$141(E21)
ZZ.13.133: U$15.P$168(F18)
ZZ.14.112: U$15.P$59(B29)
ZZ.14.113: U$15.P$89(C29)
ZZ.14.114: U$15.P$119(D29)
ZZ.14.115: U$15.P$179(F29)
ZZ.14.116: U$15.P$173(F23)
ZZ.14.117: U$15.P$143(E23)
ZZ.14.118: U$15.P$58(B28)
ZZ.14.119: U$15.P$88(C28)
ZZ.14.120: U$15.P$118(D28)
ZZ.14.121: U$15.P$149(E29)
ZZ.14.122: U$15.P$144(E24)
ZZ.14.123: U$15.P$57(B27)
ZZ.14.124: U$15.P$87(C27)
ZZ.14.125: U$15.P$117(D27)
ZZ.14.126: U$15.P$178(F28)
ZZ.14.127: U$15.P$145(E25)
ZZ.15.112: U$15.P$54(B24)
ZZ.15.113: U$15.P$84(C24)
ZZ.15.114: U$15.P$114(D24)
ZZ.15.115: U$15.P$147(E27)
ZZ.15.116: U$15.P$176(F26)
ZZ.15.117: U$15.P$174(F24)
ZZ.15.118: U$15.P$55(B25)
ZZ.15.119: U$15.P$85(C25)
ZZ.15.120: U$15.P$115(D25)
ZZ.15.121: U$15.P$177(F27)
ZZ.15.122: U$15.P$146(E26)
ZZ.15.123: U$15.P$56(B26)
ZZ.15.124: U$15.P$86(C26)
ZZ.15.125: U$15.P$116(D26)
ZZ.15.126: U$15.P$148(E28)
ZZ.15.127: U$15.P$175(F25)
Unconnected: U$16.P$30(A30)

## Sheet 9 of 12
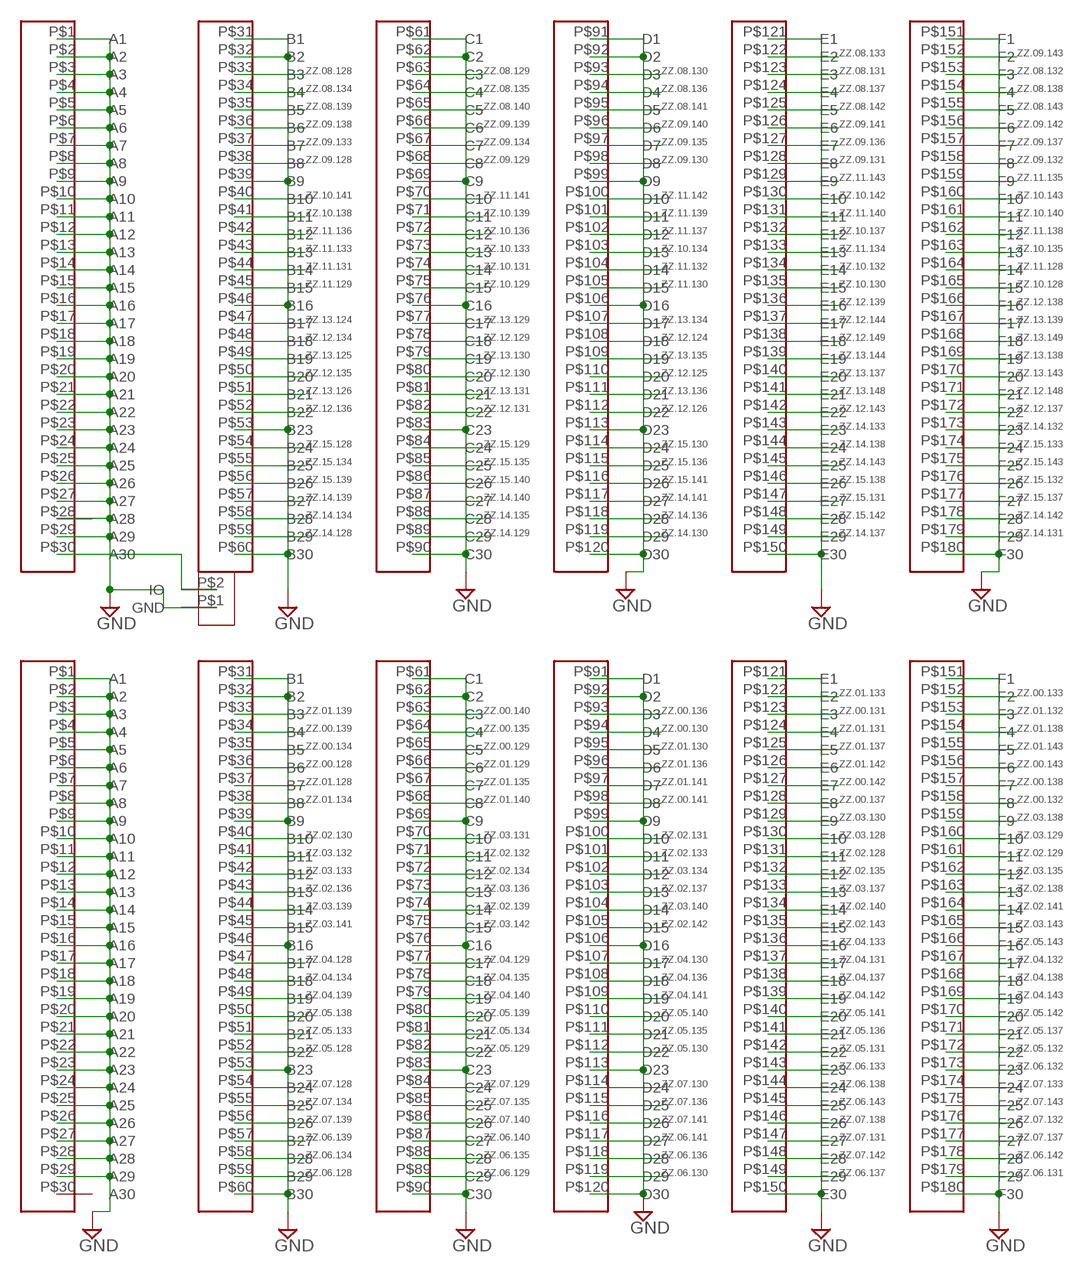
[diagram p8: schematic, sheet 9]

### Parts
U$17  SEAM-30-02.0-L-06-1-A-K-TR  [SEAM-30-02.0-L-06-1-A-K-TR]
U$18  SEAM-30-02.0-L-06-1-A-K-TR  [SEAM-30-02.0-L-06-1-A-K-TR]
U$33  DS2431  [SD2431]

### Nets
GND: U$17.P$1(A1) U$17.P$2(A2) U$17.P$3(A3) U$17.P$4(A4) U$17.P$5(A5) U$17.P$6(A6) U$17.P$7(A7) U$17.P$8(A8) U$17.P$9(A9) U$17.P$10(A10) U$17.P$11(A11) U$17.P$12(A12) U$17.P$13(A13) U$17.P$14(A14) U$17.P$15(A15) U$17.P$16(A16) U$17.P$17(A17) U$17.P$18(A18) U$17.P$19(A19) U$17.P$20(A20) U$17.P$21(A21) U$17.P$22(A22) U$17.P$23(A23) U$17.P$24(A24) U$17.P$25(A25) U$17.P$26(A26) U$17.P$27(A27) U$17.P$28(A28) U$17.P$29(A29) U$17.P$31(B1) U$17.P$32(B2) U$17.P$39(B9) U$17.P$46(B16) U$17.P$53(B23) U$17.P$60(B30) U$17.P$61(C1) U$17.P$62(C2) U$17.P$69(C9) U$17.P$76(C16) U$17.P$83(C23) U$17.P$90(C30) U$17.P$91(D1) U$17.P$92(D2) U$17.P$99(D9) U$17.P$106(D16) U$17.P$113(D23) U$17.P$120(D30) U$17.P$121(E1) U$17.P$150(E30) U$17.P$151(F1) U$17.P$180(F30) U$18.P$1(A1) U$18.P$2(A2) U$18.P$3(A3) U$18.P$4(A4) U$18.P$5(A5) U$18.P$6(A6) U$18.P$7(A7) U$18.P$8(A8) U$18.P$9(A9) U$18.P$10(A10) U$18.P$11(A11) U$18.P$12(A12) U$18.P$13(A13) U$18.P$14(A14) U$18.P$15(A15) U$18.P$16(A16) U$18.P$17(A17) U$18.P$18(A18) U$18.P$19(A19) U$18.P$20(A20) U$18.P$21(A21) U$18.P$22(A22) U$18.P$23(A23) U$18.P$24(A24) U$18.P$25(A25) U$18.P$26(A26) U$18.P$27(A27) U$18.P$28(A28) U$18.P$29(A29) U$18.P$31(B1) U$18.P$32(B2) U$18.P$39(B9) U$18.P$46(B16) U$18.P$53(B23) U$18.P$60(B30) U$18.P$61(C1) U$18.P$62(C2) U$18.P$69(C9) U$18.P$76(C16) U$18.P$83(C23) U$18.P$90(C30) U$18.P$91(D1) U$18.P$92(D2) U$18.P$99(D9) U$18.P$106(D16) U$18.P$113(D23) U$18.P$120(D30) U$18.P$121(E1) U$18.P$150(E30) U$18.P$151(F1) U$18.P$180(F30) U$33.P$1(GND) ; also sheet 1,2,3,4,5,6,7,8,10,11,12
N$9: U$17.P$30(A30) U$33.P$2(IO)
ZZ.00.128: U$18.P$36(B6)
ZZ.00.129: U$18.P$65(C5)
ZZ.00.130: U$18.P$94(D4)
ZZ.00.131: U$18.P$123(E3)
ZZ.00.132: U$18.P$158(F8)
ZZ.00.133: U$18.P$152(F2)
ZZ.00.134: U$18.P$35(B5)
ZZ.00.135: U$18.P$64(C4)
ZZ.00.136: U$18.P$93(D3)
ZZ.00.137: U$18.P$128(E8)
ZZ.00.138: U$18.P$157(F7)
ZZ.00.139: U$18.P$34(B4)
ZZ.00.140: U$18.P$63(C3)
ZZ.00.141: U$18.P$98(D8)
ZZ.00.142: U$18.P$127(E7)
ZZ.00.143: U$18.P$156(F6)
ZZ.01.128: U$18.P$37(B7)
ZZ.01.129: U$18.P$66(C6)
ZZ.01.130: U$18.P$95(D5)
ZZ.01.131: U$18.P$124(E4)
ZZ.01.132: U$18.P$153(F3)
ZZ.01.133: U$18.P$122(E2)
ZZ.01.134: U$18.P$38(B8)
ZZ.01.135: U$18.P$67(C7)
ZZ.01.136: U$18.P$96(D6)
ZZ.01.137: U$18.P$125(E5)
ZZ.01.138: U$18.P$154(F4)
ZZ.01.139: U$18.P$33(B3)
ZZ.01.140: U$18.P$68(C8)
ZZ.01.141: U$18.P$97(D7)
ZZ.01.142: U$18.P$126(E6)
ZZ.01.143: U$18.P$155(F5)
ZZ.02.128: U$18.P$131(E11)
ZZ.02.129: U$18.P$161(F11)
ZZ.02.130: U$18.P$40(B10)
ZZ.02.131: U$18.P$100(D10)
ZZ.02.132: U$18.P$71(C11)
ZZ.02.133: U$18.P$101(D11)
ZZ.02.134: U$18.P$72(C12)
ZZ.02.135: U$18.P$132(E12)
ZZ.02.136: U$18.P$43(B13)
ZZ.02.137: U$18.P$103(D13)
ZZ.02.138: U$18.P$163(F13)
ZZ.02.139: U$18.P$74(C14)
ZZ.02.140: U$18.P$134(E14)
ZZ.02.141: U$18.P$164(F14)
ZZ.02.142: U$18.P$105(D15)
ZZ.02.143: U$18.P$135(E15)
ZZ.03.128: U$18.P$130(E10)
ZZ.03.129: U$18.P$160(F10)
ZZ.03.130: U$18.P$129(E9)
ZZ.03.131: U$18.P$70(C10)
ZZ.03.132: U$18.P$41(B11)
ZZ.03.133: U$18.P$42(B12)
ZZ.03.134: U$18.P$102(D12)
ZZ.03.135: U$18.P$162(F12)
ZZ.03.136: U$18.P$73(C13)
ZZ.03.137: U$18.P$133(E13)
ZZ.03.138: U$18.P$159(F9)
ZZ.03.139: U$18.P$44(B14)
ZZ.03.140: U$18.P$104(D14)
ZZ.03.141: U$18.P$45(B15)
ZZ.03.142: U$18.P$75(C15)
ZZ.03.143: U$18.P$165(F15)
ZZ.04.128: U$18.P$47(B17)
ZZ.04.129: U$18.P$77(C17)
ZZ.04.130: U$18.P$107(D17)
ZZ.04.131: U$18.P$137(E17)
ZZ.04.132: U$18.P$167(F17)
ZZ.04.133: U$18.P$136(E16)
ZZ.04.134: U$18.P$48(B18)
ZZ.04.135: U$18.P$78(C18)
ZZ.04.136: U$18.P$108(D18)
ZZ.04.137: U$18.P$138(E18)
ZZ.04.138: U$18.P$168(F18)
ZZ.04.139: U$18.P$49(B19)
ZZ.04.140: U$18.P$79(C19)
ZZ.04.141: U$18.P$109(D19)
ZZ.04.142: U$18.P$139(E19)
ZZ.04.143: U$18.P$169(F19)
ZZ.05.128: U$18.P$52(B22)
ZZ.05.129: U$18.P$82(C22)
ZZ.05.130: U$18.P$112(D22)
ZZ.05.131: U$18.P$142(E22)
ZZ.05.132: U$18.P$172(F22)
ZZ.05.133: U$18.P$51(B21)
ZZ.05.134: U$18.P$81(C21)
ZZ.05.135: U$18.P$111(D21)
ZZ.05.136: U$18.P$141(E21)
ZZ.05.137: U$18.P$171(F21)
ZZ.05.138: U$18.P$50(B20)
ZZ.05.139: U$18.P$80(C20)
ZZ.05.140: U$18.P$110(D20)
ZZ.05.141: U$18.P$140(E20)
ZZ.05.142: U$18.P$170(F20)
ZZ.05.143: U$18.P$166(F16)
ZZ.06.128: U$18.P$59(B29)
ZZ.06.129: U$18.P$89(C29)
ZZ.06.130: U$18.P$119(D29)
ZZ.06.131: U$18.P$179(F29)
ZZ.06.132: U$18.P$173(F23)
ZZ.06.133: U$18.P$143(E23)
ZZ.06.134: U$18.P$58(B28)
ZZ.06.135: U$18.P$88(C28)
ZZ.06.136: U$18.P$118(D28)
ZZ.06.137: U$18.P$149(E29)
ZZ.06.138: U$18.P$144(E24)
ZZ.06.139: U$18.P$57(B27)
ZZ.06.140: U$18.P$87(C27)
ZZ.06.141: U$18.P$117(D27)
ZZ.06.142: U$18.P$178(F28)
ZZ.06.143: U$18.P$145(E25)
ZZ.07.128: U$18.P$54(B24)
ZZ.07.129: U$18.P$84(C24)
ZZ.07.130: U$18.P$114(D24)
ZZ.07.131: U$18.P$147(E27)
ZZ.07.132: U$18.P$176(F26)
ZZ.07.133: U$18.P$174(F24)
ZZ.07.134: U$18.P$55(B25)
ZZ.07.135: U$18.P$85(C25)
ZZ.07.136: U$18.P$115(D25)
ZZ.07.137: U$18.P$177(F27)
ZZ.07.138: U$18.P$146(E26)
ZZ.07.139: U$18.P$56(B26)
ZZ.07.140: U$18.P$86(C26)
ZZ.07.141: U$18.P$116(D26)
ZZ.07.142: U$18.P$148(E28)
ZZ.07.143: U$18.P$175(F25)
ZZ.08.128: U$17.P$33(B3)
ZZ.08.129: U$17.P$63(C3)
ZZ.08.130: U$17.P$93(D3)
ZZ.08.131: U$17.P$123(E3)
ZZ.08.132: U$17.P$153(F3)
ZZ.08.133: U$17.P$122(E2)
ZZ.08.134: U$17.P$34(B4)
ZZ.08.135: U$17.P$64(C4)
ZZ.08.136: U$17.P$94(D4)
ZZ.08.137: U$17.P$124(E4)
ZZ.08.138: U$17.P$154(F4)
ZZ.08.139: U$17.P$35(B5)
ZZ.08.140: U$17.P$65(C5)
ZZ.08.141: U$17.P$95(D5)
ZZ.08.142: U$17.P$125(E5)
ZZ.08.143: U$17.P$155(F5)
ZZ.09.128: U$17.P$38(B8)
ZZ.09.129: U$17.P$68(C8)
ZZ.09.130: U$17.P$98(D8)
ZZ.09.131: U$17.P$128(E8)
ZZ.09.132: U$17.P$158(F8)
ZZ.09.133: U$17.P$37(B7)
ZZ.09.134: U$17.P$67(C7)
ZZ.09.135: U$17.P$97(D7)
ZZ.09.136: U$17.P$127(E7)
ZZ.09.137: U$17.P$157(F7)
ZZ.09.138: U$17.P$36(B6)
ZZ.09.139: U$17.P$66(C6)
ZZ.09.140: U$17.P$96(D6)
ZZ.09.141: U$17.P$126(E6)
ZZ.09.142: U$17.P$156(F6)
ZZ.09.143: U$17.P$152(F2)
ZZ.10.128: U$17.P$165(F15)
ZZ.10.129: U$17.P$75(C15)
ZZ.10.130: U$17.P$135(E15)
ZZ.10.131: U$17.P$74(C14)
ZZ.10.132: U$17.P$134(E14)
ZZ.10.133: U$17.P$73(C13)
ZZ.10.134: U$17.P$103(D13)
ZZ.10.135: U$17.P$163(F13)
ZZ.10.136: U$17.P$72(C12)
ZZ.10.137: U$17.P$132(E12)
ZZ.10.138: U$17.P$41(B11)
ZZ.10.139: U$17.P$71(C11)
ZZ.10.140: U$17.P$161(F11)
ZZ.10.141: U$17.P$40(B10)
ZZ.10.142: U$17.P$130(E10)
ZZ.10.143: U$17.P$160(F10)
ZZ.11.128: U$17.P$164(F14)
ZZ.11.129: U$17.P$45(B15)
ZZ.11.130: U$17.P$105(D15)
ZZ.11.131: U$17.P$44(B14)
ZZ.11.132: U$17.P$104(D14)
ZZ.11.133: U$17.P$43(B13)
ZZ.11.134: U$17.P$133(E13)
ZZ.11.135: U$17.P$159(F9)
ZZ.11.136: U$17.P$42(B12)
ZZ.11.137: U$17.P$102(D12)
ZZ.11.138: U$17.P$162(F12)
ZZ.11.139: U$17.P$101(D11)
ZZ.11.140: U$17.P$131(E11)
ZZ.11.141: U$17.P$70(C10)
ZZ.11.142: U$17.P$100(D10)
ZZ.11.143: U$17.P$129(E9)
ZZ.12.124: U$17.P$108(D18)
ZZ.12.125: U$17.P$110(D20)
ZZ.12.126: U$17.P$112(D22)
ZZ.12.129: U$17.P$78(C18)
ZZ.12.130: U$17.P$80(C20)
ZZ.12.131: U$17.P$82(C22)
ZZ.12.134: U$17.P$48(B18)
ZZ.12.135: U$17.P$50(B20)
ZZ.12.136: U$17.P$52(B22)
ZZ.12.137: U$17.P$172(F22)
ZZ.12.138: U$17.P$166(F16)
ZZ.12.139: U$17.P$136(E16)
ZZ.12.143: U$17.P$142(E22)
ZZ.12.144: U$17.P$137(E17)
ZZ.12.148: U$17.P$171(F21)
ZZ.12.149: U$17.P$138(E18)
ZZ.13.124: U$17.P$47(B17)
ZZ.13.125: U$17.P$49(B19)
ZZ.13.126: U$17.P$51(B21)
ZZ.13.129: U$17.P$77(C17)
ZZ.13.130: U$17.P$79(C19)
ZZ.13.131: U$17.P$81(C21)
ZZ.13.134: U$17.P$107(D17)
ZZ.13.135: U$17.P$109(D19)
ZZ.13.136: U$17.P$111(D21)
ZZ.13.137: U$17.P$140(E20)
ZZ.13.138: U$17.P$169(F19)
ZZ.13.139: U$17.P$167(F17)
ZZ.13.143: U$17.P$170(F20)
ZZ.13.144: U$17.P$139(E19)
ZZ.13.148: U$17.P$141(E21)
ZZ.13.149: U$17.P$168(F18)
ZZ.14.128: U$17.P$59(B29)
ZZ.14.129: U$17.P$89(C29)
ZZ.14.130: U$17.P$119(D29)
ZZ.14.131: U$17.P$179(F29)
ZZ.14.132: U$17.P$173(F23)
ZZ.14.133: U$17.P$143(E23)
ZZ.14.134: U$17.P$58(B28)
ZZ.14.135: U$17.P$88(C28)
ZZ.14.136: U$17.P$118(D28)
ZZ.14.137: U$17.P$149(E29)
ZZ.14.138: U$17.P$144(E24)
ZZ.14.139: U$17.P$57(B27)
ZZ.14.140: U$17.P$87(C27)
ZZ.14.141: U$17.P$117(D27)
ZZ.14.142: U$17.P$178(F28)
ZZ.14.143: U$17.P$145(E25)
ZZ.15.128: U$17.P$54(B24)
ZZ.15.129: U$17.P$84(C24)
ZZ.15.130: U$17.P$114(D24)
ZZ.15.131: U$17.P$147(E27)
ZZ.15.132: U$17.P$176(F26)
ZZ.15.133: U$17.P$174(F24)
ZZ.15.134: U$17.P$55(B25)
ZZ.15.135: U$17.P$85(C25)
ZZ.15.136: U$17.P$115(D25)
ZZ.15.137: U$17.P$177(F27)
ZZ.15.138: U$17.P$146(E26)
ZZ.15.139: U$17.P$56(B26)
ZZ.15.140: U$17.P$86(C26)
ZZ.15.141: U$17.P$116(D26)
ZZ.15.142: U$17.P$148(E28)
ZZ.15.143: U$17.P$175(F25)
Unconnected: U$18.P$30(A30)

## Sheet 10 of 12
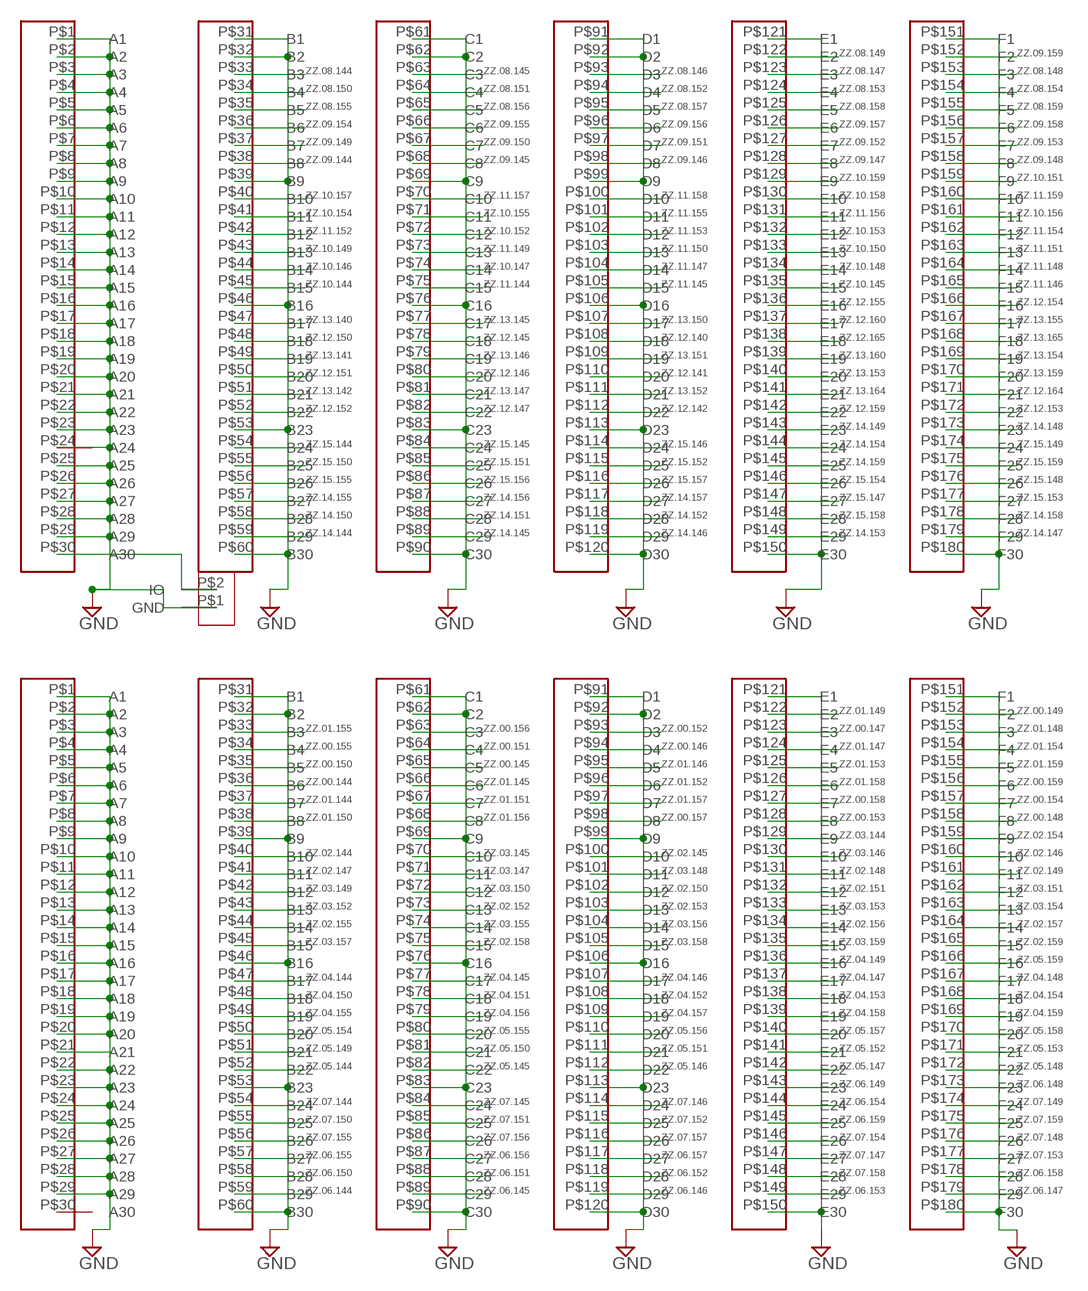
[diagram p9: schematic, sheet 10]

### Parts
U$19  SEAM-30-02.0-L-06-1-A-K-TR  [SEAM-30-02.0-L-06-1-A-K-TR]
U$20  SEAM-30-02.0-L-06-1-A-K-TR  [SEAM-30-02.0-L-06-1-A-K-TR]
U$34  DS2431  [SD2431]

### Nets
GND: U$19.P$1(A1) U$19.P$2(A2) U$19.P$3(A3) U$19.P$4(A4) U$19.P$5(A5) U$19.P$6(A6) U$19.P$7(A7) U$19.P$8(A8) U$19.P$9(A9) U$19.P$10(A10) U$19.P$11(A11) U$19.P$12(A12) U$19.P$13(A13) U$19.P$14(A14) U$19.P$15(A15) U$19.P$16(A16) U$19.P$17(A17) U$19.P$18(A18) U$19.P$19(A19) U$19.P$20(A20) U$19.P$21(A21) U$19.P$22(A22) U$19.P$23(A23) U$19.P$24(A24) U$19.P$25(A25) U$19.P$26(A26) U$19.P$27(A27) U$19.P$28(A28) U$19.P$29(A29) U$19.P$31(B1) U$19.P$32(B2) U$19.P$39(B9) U$19.P$46(B16) U$19.P$53(B23) U$19.P$60(B30) U$19.P$61(C1) U$19.P$62(C2) U$19.P$69(C9) U$19.P$76(C16) U$19.P$83(C23) U$19.P$90(C30) U$19.P$91(D1) U$19.P$92(D2) U$19.P$99(D9) U$19.P$106(D16) U$19.P$113(D23) U$19.P$120(D30) U$19.P$121(E1) U$19.P$150(E30) U$19.P$151(F1) U$19.P$180(F30) U$20.P$1(A1) U$20.P$2(A2) U$20.P$3(A3) U$20.P$4(A4) U$20.P$5(A5) U$20.P$6(A6) U$20.P$7(A7) U$20.P$8(A8) U$20.P$9(A9) U$20.P$10(A10) U$20.P$11(A11) U$20.P$12(A12) U$20.P$13(A13) U$20.P$14(A14) U$20.P$15(A15) U$20.P$16(A16) U$20.P$17(A17) U$20.P$18(A18) U$20.P$19(A19) U$20.P$20(A20) U$20.P$21(A21) U$20.P$22(A22) U$20.P$23(A23) U$20.P$24(A24) U$20.P$25(A25) U$20.P$26(A26) U$20.P$27(A27) U$20.P$28(A28) U$20.P$29(A29) U$20.P$31(B1) U$20.P$32(B2) U$20.P$39(B9) U$20.P$46(B16) U$20.P$53(B23) U$20.P$60(B30) U$20.P$61(C1) U$20.P$62(C2) U$20.P$69(C9) U$20.P$76(C16) U$20.P$83(C23) U$20.P$90(C30) U$20.P$91(D1) U$20.P$92(D2) U$20.P$99(D9) U$20.P$106(D16) U$20.P$113(D23) U$20.P$120(D30) U$20.P$121(E1) U$20.P$150(E30) U$20.P$151(F1) U$20.P$180(F30) U$34.P$1(GND) ; also sheet 1,2,3,4,5,6,7,8,9,11,12
N$10: U$19.P$30(A30) U$34.P$2(IO)
ZZ.00.144: U$20.P$36(B6)
ZZ.00.145: U$20.P$65(C5)
ZZ.00.146: U$20.P$94(D4)
ZZ.00.147: U$20.P$123(E3)
ZZ.00.148: U$20.P$158(F8)
ZZ.00.149: U$20.P$152(F2)
ZZ.00.150: U$20.P$35(B5)
ZZ.00.151: U$20.P$64(C4)
ZZ.00.152: U$20.P$93(D3)
ZZ.00.153: U$20.P$128(E8)
ZZ.00.154: U$20.P$157(F7)
ZZ.00.155: U$20.P$34(B4)
ZZ.00.156: U$20.P$63(C3)
ZZ.00.157: U$20.P$98(D8)
ZZ.00.158: U$20.P$127(E7)
ZZ.00.159: U$20.P$156(F6)
ZZ.01.144: U$20.P$37(B7)
ZZ.01.145: U$20.P$66(C6)
ZZ.01.146: U$20.P$95(D5)
ZZ.01.147: U$20.P$124(E4)
ZZ.01.148: U$20.P$153(F3)
ZZ.01.149: U$20.P$122(E2)
ZZ.01.150: U$20.P$38(B8)
ZZ.01.151: U$20.P$67(C7)
ZZ.01.152: U$20.P$96(D6)
ZZ.01.153: U$20.P$125(E5)
ZZ.01.154: U$20.P$154(F4)
ZZ.01.155: U$20.P$33(B3)
ZZ.01.156: U$20.P$68(C8)
ZZ.01.157: U$20.P$97(D7)
ZZ.01.158: U$20.P$126(E6)
ZZ.01.159: U$20.P$155(F5)
ZZ.02.144: U$20.P$40(B10)
ZZ.02.145: U$20.P$100(D10)
ZZ.02.146: U$20.P$160(F10)
ZZ.02.147: U$20.P$41(B11)
ZZ.02.148: U$20.P$131(E11)
ZZ.02.149: U$20.P$161(F11)
ZZ.02.150: U$20.P$102(D12)
ZZ.02.151: U$20.P$132(E12)
ZZ.02.152: U$20.P$73(C13)
ZZ.02.153: U$20.P$103(D13)
ZZ.02.154: U$20.P$159(F9)
ZZ.02.155: U$20.P$44(B14)
ZZ.02.156: U$20.P$134(E14)
ZZ.02.157: U$20.P$164(F14)
ZZ.02.158: U$20.P$75(C15)
ZZ.02.159: U$20.P$165(F15)
ZZ.03.144: U$20.P$129(E9)
ZZ.03.145: U$20.P$70(C10)
ZZ.03.146: U$20.P$130(E10)
ZZ.03.147: U$20.P$71(C11)
ZZ.03.148: U$20.P$101(D11)
ZZ.03.149: U$20.P$42(B12)
ZZ.03.150: U$20.P$72(C12)
ZZ.03.151: U$20.P$162(F12)
ZZ.03.152: U$20.P$43(B13)
ZZ.03.153: U$20.P$133(E13)
ZZ.03.154: U$20.P$163(F13)
ZZ.03.155: U$20.P$74(C14)
ZZ.03.156: U$20.P$104(D14)
ZZ.03.157: U$20.P$45(B15)
ZZ.03.158: U$20.P$105(D15)
ZZ.03.159: U$20.P$135(E15)
ZZ.04.144: U$20.P$47(B17)
ZZ.04.145: U$20.P$77(C17)
ZZ.04.146: U$20.P$107(D17)
ZZ.04.147: U$20.P$137(E17)
ZZ.04.148: U$20.P$167(F17)
ZZ.04.149: U$20.P$136(E16)
ZZ.04.150: U$20.P$48(B18)
ZZ.04.151: U$20.P$78(C18)
ZZ.04.152: U$20.P$108(D18)
ZZ.04.153: U$20.P$138(E18)
ZZ.04.154: U$20.P$168(F18)
ZZ.04.155: U$20.P$49(B19)
ZZ.04.156: U$20.P$79(C19)
ZZ.04.157: U$20.P$109(D19)
ZZ.04.158: U$20.P$139(E19)
ZZ.04.159: U$20.P$169(F19)
ZZ.05.144: U$20.P$52(B22)
ZZ.05.145: U$20.P$82(C22)
ZZ.05.146: U$20.P$112(D22)
ZZ.05.147: U$20.P$142(E22)
ZZ.05.148: U$20.P$172(F22)
ZZ.05.149: U$20.P$51(B21)
ZZ.05.150: U$20.P$81(C21)
ZZ.05.151: U$20.P$111(D21)
ZZ.05.152: U$20.P$141(E21)
ZZ.05.153: U$20.P$171(F21)
ZZ.05.154: U$20.P$50(B20)
ZZ.05.155: U$20.P$80(C20)
ZZ.05.156: U$20.P$110(D20)
ZZ.05.157: U$20.P$140(E20)
ZZ.05.158: U$20.P$170(F20)
ZZ.05.159: U$20.P$166(F16)
ZZ.06.144: U$20.P$59(B29)
ZZ.06.145: U$20.P$89(C29)
ZZ.06.146: U$20.P$119(D29)
ZZ.06.147: U$20.P$179(F29)
ZZ.06.148: U$20.P$173(F23)
ZZ.06.149: U$20.P$143(E23)
ZZ.06.150: U$20.P$58(B28)
ZZ.06.151: U$20.P$88(C28)
ZZ.06.152: U$20.P$118(D28)
ZZ.06.153: U$20.P$149(E29)
ZZ.06.154: U$20.P$144(E24)
ZZ.06.155: U$20.P$57(B27)
ZZ.06.156: U$20.P$87(C27)
ZZ.06.157: U$20.P$117(D27)
ZZ.06.158: U$20.P$178(F28)
ZZ.06.159: U$20.P$145(E25)
ZZ.07.144: U$20.P$54(B24)
ZZ.07.145: U$20.P$84(C24)
ZZ.07.146: U$20.P$114(D24)
ZZ.07.147: U$20.P$147(E27)
ZZ.07.148: U$20.P$176(F26)
ZZ.07.149: U$20.P$174(F24)
ZZ.07.150: U$20.P$55(B25)
ZZ.07.151: U$20.P$85(C25)
ZZ.07.152: U$20.P$115(D25)
ZZ.07.153: U$20.P$177(F27)
ZZ.07.154: U$20.P$146(E26)
ZZ.07.155: U$20.P$56(B26)
ZZ.07.156: U$20.P$86(C26)
ZZ.07.157: U$20.P$116(D26)
ZZ.07.158: U$20.P$148(E28)
ZZ.07.159: U$20.P$175(F25)
ZZ.08.144: U$19.P$33(B3)
ZZ.08.145: U$19.P$63(C3)
ZZ.08.146: U$19.P$93(D3)
ZZ.08.147: U$19.P$123(E3)
ZZ.08.148: U$19.P$153(F3)
ZZ.08.149: U$19.P$122(E2)
ZZ.08.150: U$19.P$34(B4)
ZZ.08.151: U$19.P$64(C4)
ZZ.08.152: U$19.P$94(D4)
ZZ.08.153: U$19.P$124(E4)
ZZ.08.154: U$19.P$154(F4)
ZZ.08.155: U$19.P$35(B5)
ZZ.08.156: U$19.P$65(C5)
ZZ.08.157: U$19.P$95(D5)
ZZ.08.158: U$19.P$125(E5)
ZZ.08.159: U$19.P$155(F5)
ZZ.09.144: U$19.P$38(B8)
ZZ.09.145: U$19.P$68(C8)
ZZ.09.146: U$19.P$98(D8)
ZZ.09.147: U$19.P$128(E8)
ZZ.09.148: U$19.P$158(F8)
ZZ.09.149: U$19.P$37(B7)
ZZ.09.150: U$19.P$67(C7)
ZZ.09.151: U$19.P$97(D7)
ZZ.09.152: U$19.P$127(E7)
ZZ.09.153: U$19.P$157(F7)
ZZ.09.154: U$19.P$36(B6)
ZZ.09.155: U$19.P$66(C6)
ZZ.09.156: U$19.P$96(D6)
ZZ.09.157: U$19.P$126(E6)
ZZ.09.158: U$19.P$156(F6)
ZZ.09.159: U$19.P$152(F2)
ZZ.10.144: U$19.P$45(B15)
ZZ.10.145: U$19.P$135(E15)
ZZ.10.146: U$19.P$44(B14)
ZZ.10.147: U$19.P$74(C14)
ZZ.10.148: U$19.P$134(E14)
ZZ.10.149: U$19.P$43(B13)
ZZ.10.150: U$19.P$133(E13)
ZZ.10.151: U$19.P$159(F9)
ZZ.10.152: U$19.P$72(C12)
ZZ.10.153: U$19.P$132(E12)
ZZ.10.154: U$19.P$41(B11)
ZZ.10.155: U$19.P$71(C11)
ZZ.10.156: U$19.P$161(F11)
ZZ.10.157: U$19.P$40(B10)
ZZ.10.158: U$19.P$130(E10)
ZZ.10.159: U$19.P$129(E9)
ZZ.11.144: U$19.P$75(C15)
ZZ.11.145: U$19.P$105(D15)
ZZ.11.146: U$19.P$165(F15)
ZZ.11.147: U$19.P$104(D14)
ZZ.11.148: U$19.P$164(F14)
ZZ.11.149: U$19.P$73(C13)
ZZ.11.150: U$19.P$103(D13)
ZZ.11.151: U$19.P$163(F13)
ZZ.11.152: U$19.P$42(B12)
ZZ.11.153: U$19.P$102(D12)
ZZ.11.154: U$19.P$162(F12)
ZZ.11.155: U$19.P$101(D11)
ZZ.11.156: U$19.P$131(E11)
ZZ.11.157: U$19.P$70(C10)
ZZ.11.158: U$19.P$100(D10)
ZZ.11.159: U$19.P$160(F10)
ZZ.12.140: U$19.P$108(D18)
ZZ.12.141: U$19.P$110(D20)
ZZ.12.142: U$19.P$112(D22)
ZZ.12.145: U$19.P$78(C18)
ZZ.12.146: U$19.P$80(C20)
ZZ.12.147: U$19.P$82(C22)
ZZ.12.150: U$19.P$48(B18)
ZZ.12.151: U$19.P$50(B20)
ZZ.12.152: U$19.P$52(B22)
ZZ.12.153: U$19.P$172(F22)
ZZ.12.154: U$19.P$166(F16)
ZZ.12.155: U$19.P$136(E16)
ZZ.12.159: U$19.P$142(E22)
ZZ.12.160: U$19.P$137(E17)
ZZ.12.164: U$19.P$171(F21)
ZZ.12.165: U$19.P$138(E18)
ZZ.13.140: U$19.P$47(B17)
ZZ.13.141: U$19.P$49(B19)
ZZ.13.142: U$19.P$51(B21)
ZZ.13.145: U$19.P$77(C17)
ZZ.13.146: U$19.P$79(C19)
ZZ.13.147: U$19.P$81(C21)
ZZ.13.150: U$19.P$107(D17)
ZZ.13.151: U$19.P$109(D19)
ZZ.13.152: U$19.P$111(D21)
ZZ.13.153: U$19.P$140(E20)
ZZ.13.154: U$19.P$169(F19)
ZZ.13.155: U$19.P$167(F17)
ZZ.13.159: U$19.P$170(F20)
ZZ.13.160: U$19.P$139(E19)
ZZ.13.164: U$19.P$141(E21)
ZZ.13.165: U$19.P$168(F18)
ZZ.14.144: U$19.P$59(B29)
ZZ.14.145: U$19.P$89(C29)
ZZ.14.146: U$19.P$119(D29)
ZZ.14.147: U$19.P$179(F29)
ZZ.14.148: U$19.P$173(F23)
ZZ.14.149: U$19.P$143(E23)
ZZ.14.150: U$19.P$58(B28)
ZZ.14.151: U$19.P$88(C28)
ZZ.14.152: U$19.P$118(D28)
ZZ.14.153: U$19.P$149(E29)
ZZ.14.154: U$19.P$144(E24)
ZZ.14.155: U$19.P$57(B27)
ZZ.14.156: U$19.P$87(C27)
ZZ.14.157: U$19.P$117(D27)
ZZ.14.158: U$19.P$178(F28)
ZZ.14.159: U$19.P$145(E25)
ZZ.15.144: U$19.P$54(B24)
ZZ.15.145: U$19.P$84(C24)
ZZ.15.146: U$19.P$114(D24)
ZZ.15.147: U$19.P$147(E27)
ZZ.15.148: U$19.P$176(F26)
ZZ.15.149: U$19.P$174(F24)
ZZ.15.150: U$19.P$55(B25)
ZZ.15.151: U$19.P$85(C25)
ZZ.15.152: U$19.P$115(D25)
ZZ.15.153: U$19.P$177(F27)
ZZ.15.154: U$19.P$146(E26)
ZZ.15.155: U$19.P$56(B26)
ZZ.15.156: U$19.P$86(C26)
ZZ.15.157: U$19.P$116(D26)
ZZ.15.158: U$19.P$148(E28)
ZZ.15.159: U$19.P$175(F25)
Unconnected: U$20.P$30(A30)